# EAGLE design matrix (EAGLE 7.7.0)
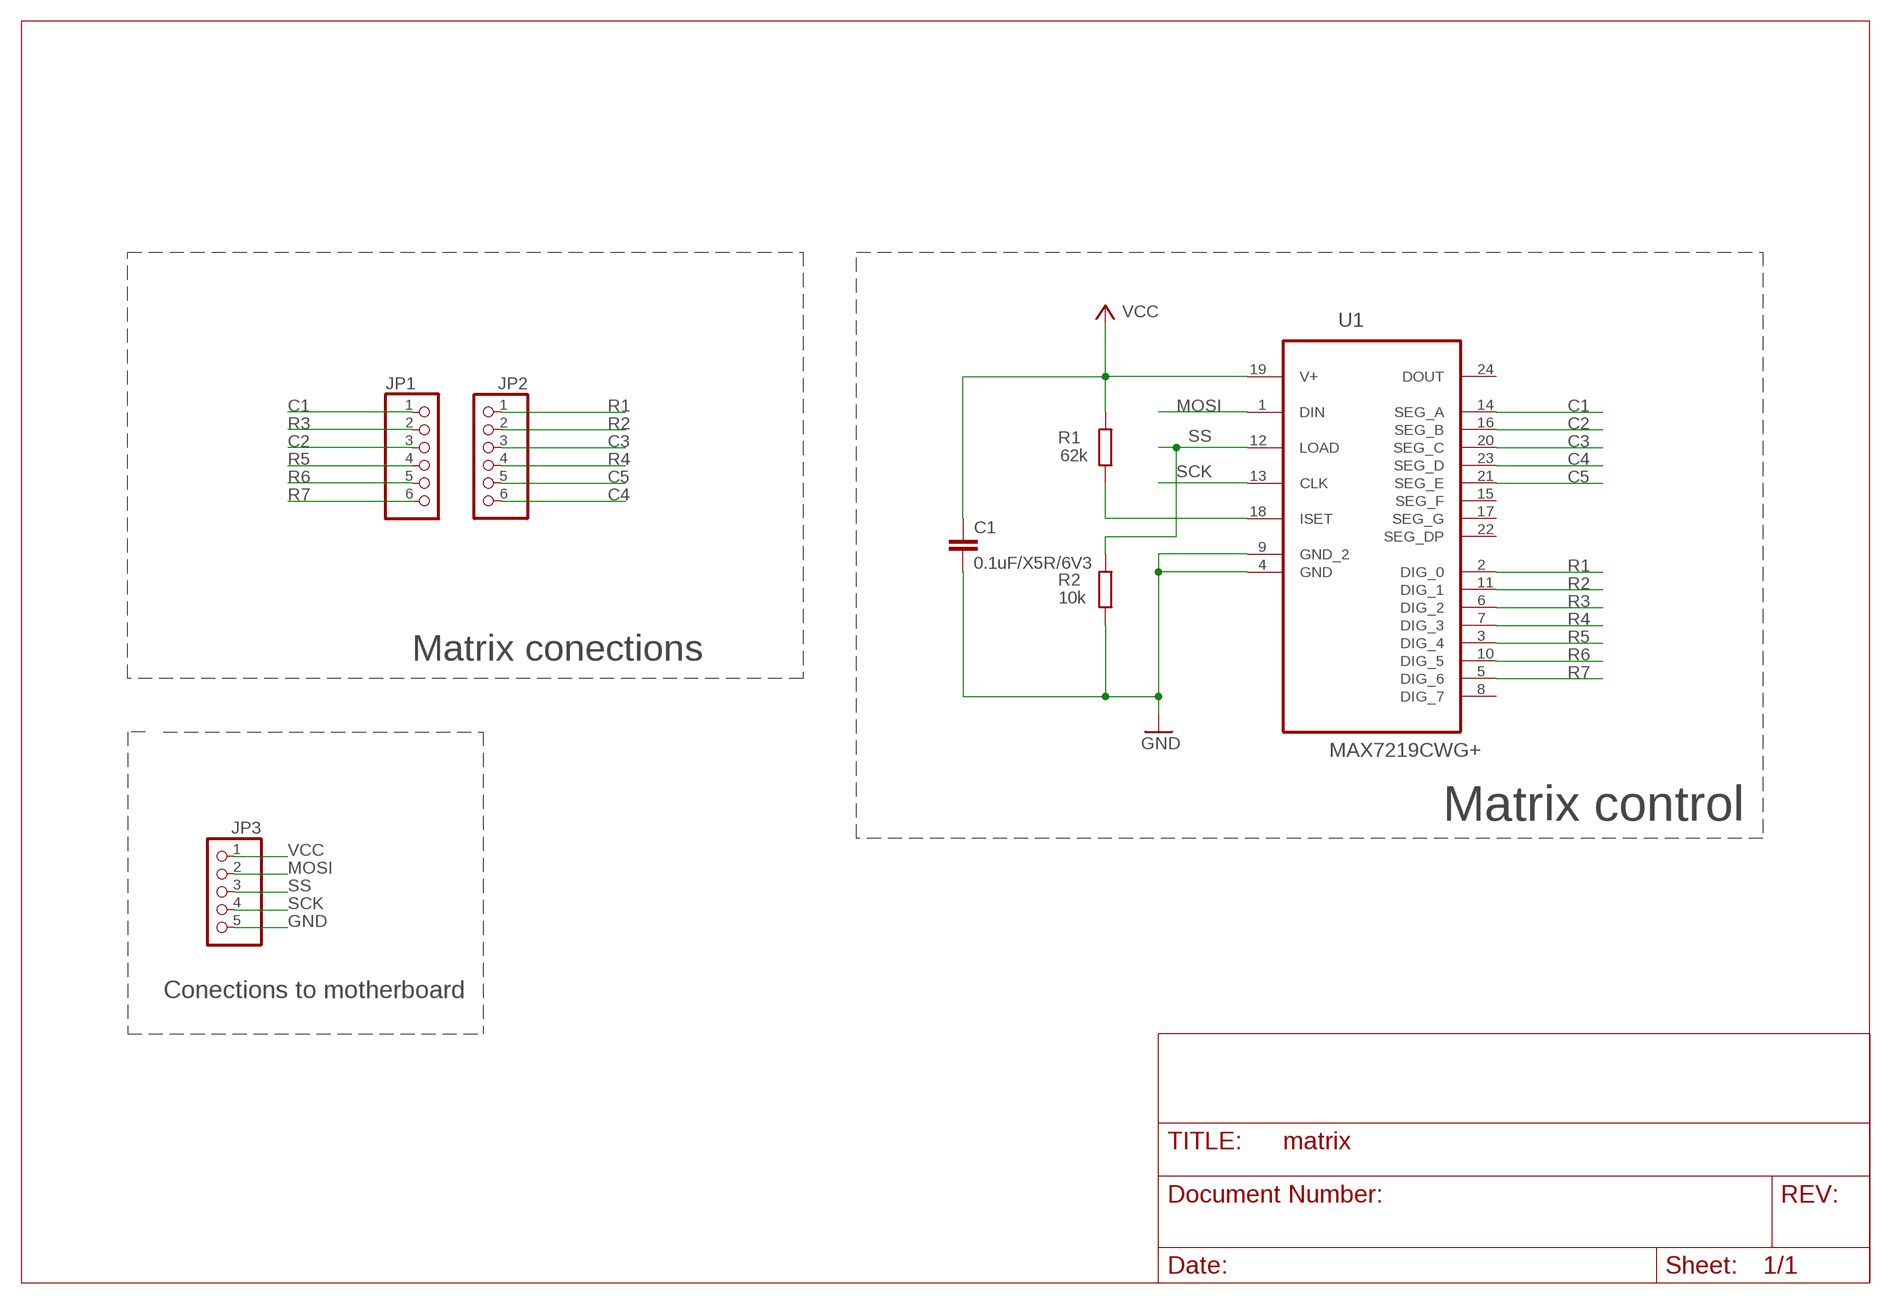
[diagram p0: schematic, sheet 1]

## Parts
C1  0.1uF/X5R/6V3  C-EUC1206  [C1206]
JP1  PINHD-1X6  [1X06]
JP2  PINHD-1X6  [1X06]
JP3  PINHD-1X5  [1X05]
R1  62k  R-EU_R0805  [R0805]
R2  10k  R-EU_R0805  [R0805]
U1  MAX7219CWG+  [SOIC127P1032X265-24N]

## Nets
C1: JP1.1 U1.14(SEG_A)
C2: JP1.3 U1.16(SEG_B)
C3: JP2.3 U1.20(SEG_C)
C4: JP2.6 U1.23(SEG_D)
C5: JP2.5 U1.21(SEG_E)
GND: C1.2 JP3.5 R2.1 U1.4(GND) U1.9(GND_2)
MOSI: JP3.2 U1.1(DIN)
N$20: R1.1 U1.18(ISET)
R1: JP2.1 U1.2(DIG_0)
R2: JP2.2 U1.11(DIG_1)
R3: JP1.2 U1.6(DIG_2)
R4: JP2.4 U1.7(DIG_3)
R5: JP1.4 U1.3(DIG_4)
R6: JP1.5 U1.10(DIG_5)
R7: JP1.6 U1.5(DIG_6)
SCK: JP3.4 U1.13(CLK)
SS: JP3.3 R2.2 U1.12(LOAD)
VCC: C1.1 JP3.1 R1.2 U1.19(V+)
Unconnected: U1.8(DIG_7) U1.15(SEG_F) U1.17(SEG_G) U1.22(SEG_DP) U1.24(DOUT)

## Notes on the sheet
- Matrix conections
- Matrix control
- Conections to motherboard

## Library data of the parts
C1 = rcl:C-EU: CAPACITOR, European symbol
JP1 JP2 = pinhead:PINHD-1X6: PIN HEADER
JP3 = pinhead:PINHD-1X5: PIN HEADER
R1 R2 = rcl:R-EU_: RESISTOR, European symbol
U1 = maxim7219:MAX7219CWG+: Serially Interfaced, 8-Digit LED Display Drivers; MPN: MAX7219CWG+; OC_FARNELL: 9726357; OC_NEWARK: 67K6644; PACKAGE: SOIC-24; SUPPLIER: Maxim

## Board
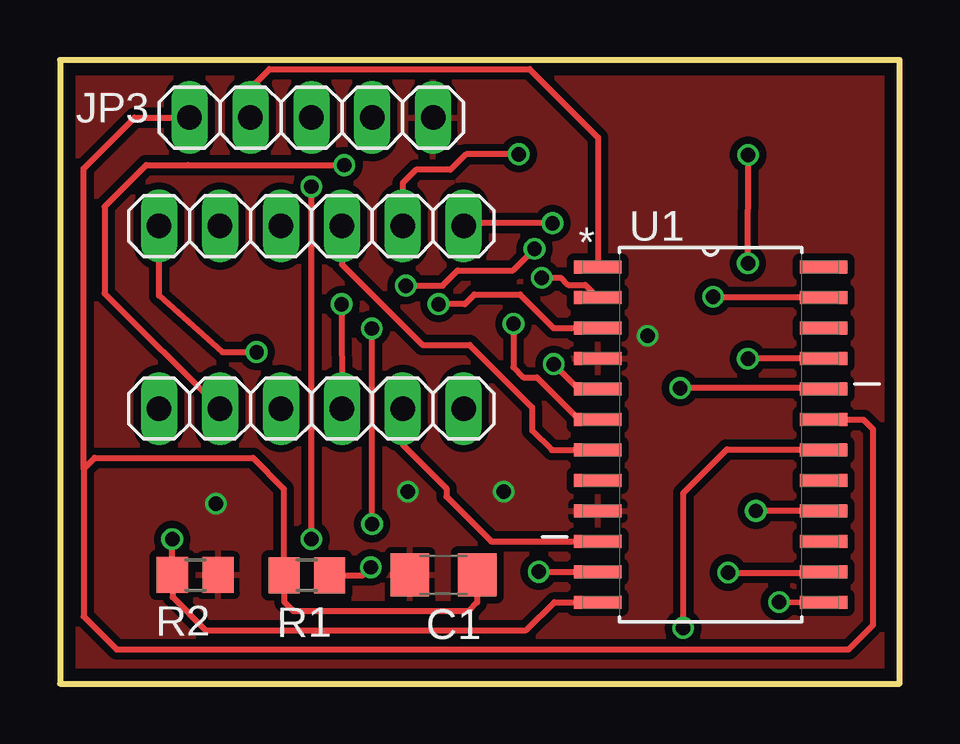
[diagram p1: board, top side]
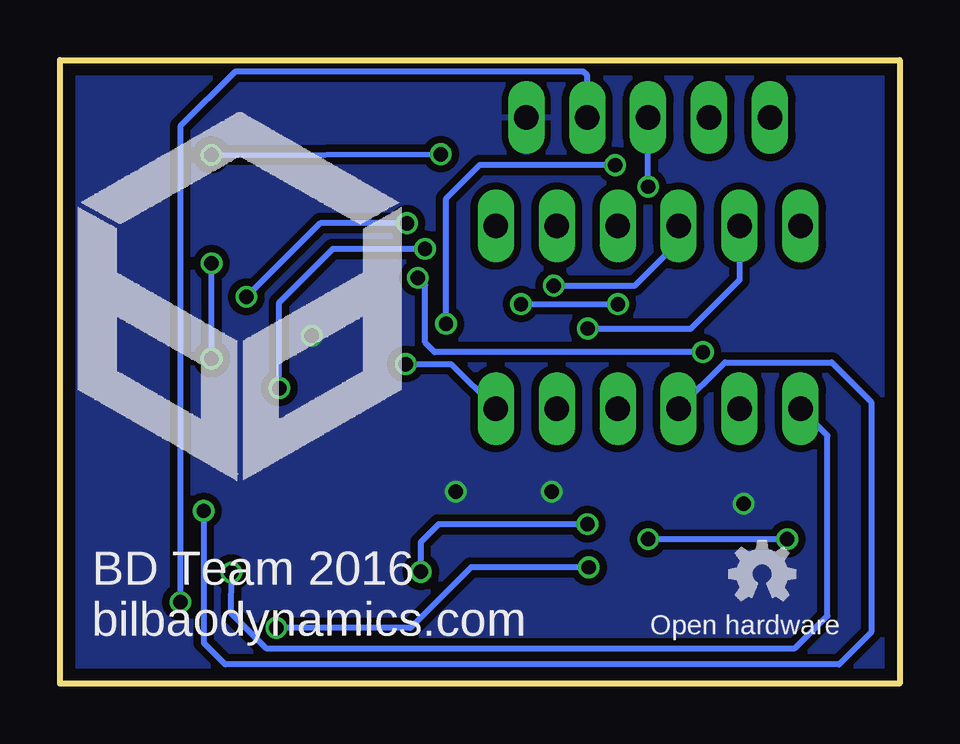
[diagram p2: board, bottom side, seen from below]

Size 35 x 26 mm. Coordinates in mm from the lower left corner, seen from the top.
Outline: 0,0 35,0 35,26 0,26 0,0
Copper layers (1*16): Top 0.035mm / dielectric 1.5mm / Bottom 0.035mm
Design rules "EagleRules": minimum track width 7mil, minimum drill 12mil, track to track 7mil, track to pad 7mil, pad to pad 7mil, via to via 7mil, smd to smd 0mil, copper to edge 20mil, drill to drill 10mil, minimum pad ring 10mil, minimum via ring 6mil, stop-mask expansion 2mil, vias tented up to drill 25mil, thermal gap 10mil

### Footprints (pad centres in the part's own frame; a part is rotated, then mirrored left to right if it is on the bottom)
C1206 = smd 1.6 x 1.8: 1 -1.4,0; 2 1.4,0
1X06 = drill 1.016 long: 1 -6.35,0; 2 -3.81,0; 3 -1.27,0; 4 1.27,0; 5 3.81,0; 6 6.35,0
1X05 = drill 1.016 long: 1 -5.08,0; 2 -2.54,0; 3 0,0; 4 2.54,0; 5 5.08,0
R0805 = smd 1.3 x 1.5: 1 -0.95,0; 2 0.95,0
SOIC127P1032X265-24N = smd 1.981 x 0.533: 1 -4.699,6.985; 2 -4.699,5.715; 3 -4.699,4.445; 4 -4.699,3.175; 5 -4.699,1.905; 6 -4.699,0.635; 7 -4.699,-0.635; 8 -4.699,-1.905; 9 -4.699,-3.175; 10 -4.699,-4.445; 11 -4.699,-5.715; 12 -4.699,-6.985; 13 4.699,-6.985; 14 4.699,-5.715; 15 4.699,-4.445; 16 4.699,-3.175; 17 4.699,-1.905; 18 4.699,-0.635; 19 4.699,0.635; 20 4.699,1.905; 21 4.699,3.175; 22 4.699,4.445; 23 4.699,5.715; 24 4.699,6.985

### Placement (x,y rotation side)
C1  15.99,4.53 180 top
JP1  10.48,11.46 0 top
JP2  10.48,19.08 0 top
JP3  10.48,23.6 0 top
R1  10.29,4.52 180 top
R2  5.64,4.53 180 top
U1  27.12,10.38 0 top

### Tracks (layer width: path | path; a pad name or v marks a point on that pad's centre or on a via)
C1  (via drill 0.6)
  Top 0.254: v27.85,4.62 31.82,4.62
  Top 0.406: 31.82,4.62 U1.14
  Bottom 0.254: JP1.1 3,10.34 3,2.82 4.36,1.47 26.41,1.47 27.86,2.92 v27.85,4.62
C2  (via drill 0.6)
  Top 0.254: U1.16 v29.01,7.2
  Bottom 0.254: JP1.3 7.28,13.39 2.83,13.39 1.18,11.74 1.18,2.13 2.51,0.8 28.11,0.8 29,1.7 v29.01,7.2
C3  (via drill 0.6)
  Top 0.254: U1.20 31.78,12.32 v25.86,12.32 | v14.42,16.59 15.95,16.59 16.58,17.22 18.88,17.22 v19.78,18.12
  Bottom 0.254: JP2.3 9.21,18.41 11.04,16.59 v14.42,16.59 | v25.86,12.32 25.86,15.89 23.63,18.12 v19.78,18.12
C4  (via drill 0.6)
  Top 0.254: v27.23,16.12 31.79,16.12 U1.23 | v20.53,19.2 16.95,19.2 JP2.6
  Bottom 0.254: v20.53,19.2 24.16,19.2 v27.23,16.12
C5  (via drill 0.6)
  Top 0.254: 14.29,19.73 JP2.5 14.29,20.86 14.85,21.42 16.28,21.42 16.93,22.07 v19.13,22.07 | U1.21 v28.68,13.54 | v28.68,17.52 v28.69,22.04
  Bottom 0.254: v28.68,13.54 v28.68,17.52 | v28.69,22.04 v19.13,22.07
GND  (via drill 0.6)
  other vias: 24.5,14.5 6.5,7.5 14.5,8 18.5,8
  pour Bottom (isolate 0.305): 35,26 0,26 0,0 35,0
  pour Top (isolate 0.305): 0,26 0,0 35,0 35,26
MOSI
  Top 0.254: JP3.2 7.94,24.83 8.73,25.62 19.58,25.62 22.43,22.77 U1.1
N$20  (via drill 0.6)
  Top 0.254: R1.1 12.63,4.52 v12.96,4.84 | v25.98,2.32 25.98,7.95 27.8,9.77 31.79,9.77 U1.18
  Bottom 0.254: v25.98,2.32 20.39,2.32 17.86,4.85 v12.96,4.85 v12.96,4.84
R1  (via drill 0.6)
  Top 0.254: JP2.1 4.13,16.17 6.76,13.81 v8.2,13.82 | v20.08,16.92 20.88,16.92 21.18,16.62 21.9,16.62 U1.2
  Bottom 0.254: v8.2,13.82 19.38,13.82 19.78,14.22 19.78,16.62 v20.08,16.92
R2  (via drill 0.6)
  Top 0.254: v19.96,4.66 U1.11 | v13.01,6.64 13,14.57 v13,14.8
  Bottom 0.254: JP2.2 6.67,16.83 8.7,14.8 v13,14.8 | v13.01,6.64 19.21,6.64 19.96,5.89 v19.96,4.66
R3  (via drill 0.6)
  Top 0.254: v18.91,14.99 18.91,13.2 19.33,12.77 19.88,12.77 21.68,10.97 22.39,10.97 U1.6 | v11.86,21.61 5.33,21.62 3.6,21.62 1.86,19.88 1.86,16.27 JP1.2
  Bottom 0.254: v18.91,14.99 18.91,20.22 17.51,21.61 v11.86,21.61
R4
  Top 0.254: JP2.4 11.75,17.48 15.11,14.12 17.08,14.12 19.68,11.52 19.68,10.55 20.5,9.73 22.42,9.73 U1.7
R5  (via drill 0.6)
  Top 0.254: U1.3 20.58,14.82 19.18,16.22 17.28,16.22 16.88,15.82 v15.78,15.82 | v11.74,15.82 JP1.4
  Bottom 0.254: v15.78,15.82 v11.74,15.82
R6
  Top 0.254: JP1.5 14.29,9.96 16.11,8.14 16.11,7.79 17.98,5.92 22.42,5.92 U1.10
R7  (via drill 0.6)
  Top 0.254: U1.5 21.62,12.28 v20.58,13.32
  Bottom 0.254: 16.84,11.45 JP1.6 18.69,13.32 v20.58,13.32
SCK  (via drill 0.6)
  Top 0.254: U1.13 31.18,3.39 31.18,3.4 31.11,3.4 v29.98,3.4
  Bottom 0.254: JP3.4 13.02,25.36 13.18,25.52 27.69,25.52 29.98,23.23 29.98,4.09 v29.98,3.4
SS  (via drill 0.6)
  Top 0.254: U1.12 20.61,3.4 19.43,2.22 6.08,2.22 4.69,3.61 R2.2 v4.68,6.02 | v10.48,6.02 v10.48,20.72
  Bottom 0.254: v4.68,6.02 v10.48,6.02 | v10.48,20.72 JP3.3
VCC
  Top 0.254: 0.98,8.95 0.98,21.48 3.1,23.6 JP3.1 | 0.98,8.95 0.98,2.79 2.35,1.42 32.88,1.42 33.91,2.44 33.91,10.6 33.51,10.99 31.84,10.99 U1.19 | 17.41,4.54 C1.1 17.39,3.38 17.03,3.02 9.73,3.02 9.36,3.4 9.36,4.5 R1.2 9.33,8.12 8.04,9.41 1.44,9.41 0.98,8.95

### Text on the board
bPlace: Open hardware | BD Team 2016 / bilbaodynamics.com